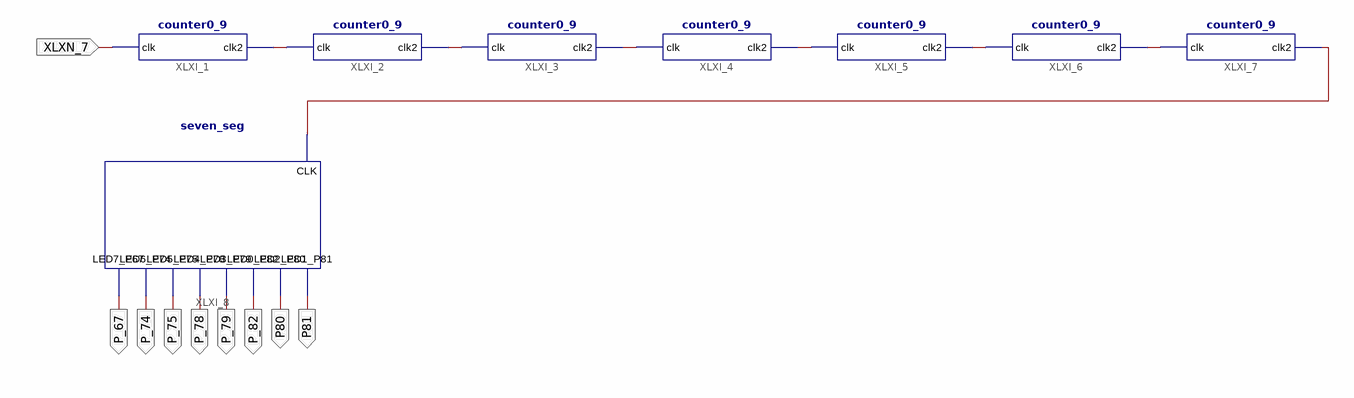
[diagram p0: schematic sheet 1]
// Xilinx ISE schematic final.sch (spartan6) as structural Verilog: 8 symbols, 9 ports
module \final  (
  input  XLXN_7,
  output P81,
  output P80,
  output P_82,
  output P_79,
  output P_78,
  output P_75,
  output P_74,
  output P_67
);

  wire XLXN_1, XLXN_2, XLXN_3, XLXN_4, XLXN_5, XLXN_6, XLXN_8;

  counter0_9 XLXI_1 (.clk(XLXN_7), .clk2(XLXN_1));
  counter0_9 XLXI_2 (.clk(XLXN_1), .clk2(XLXN_2));
  counter0_9 XLXI_3 (.clk(XLXN_2), .clk2(XLXN_3));
  counter0_9 XLXI_4 (.clk(XLXN_3), .clk2(XLXN_4));
  counter0_9 XLXI_5 (.clk(XLXN_4), .clk2(XLXN_5));
  counter0_9 XLXI_6 (.clk(XLXN_5), .clk2(XLXN_6));
  counter0_9 XLXI_7 (.clk(XLXN_6), .clk2(XLXN_8));
  seven_seg XLXI_8 (
    .CLK(XLXN_8), .LED1_P81(P81), .LED2_P80(P80), .LED0_P82(P_82), .LED3_P79(P_79), .LED4_P78(P_78),
    .LED5_P75(P_75), .LED6_P74(P_74), .LED7_P67(P_67));
endmodule
